# EAGLE design PCB_v3 (EAGLE 9.6.2)
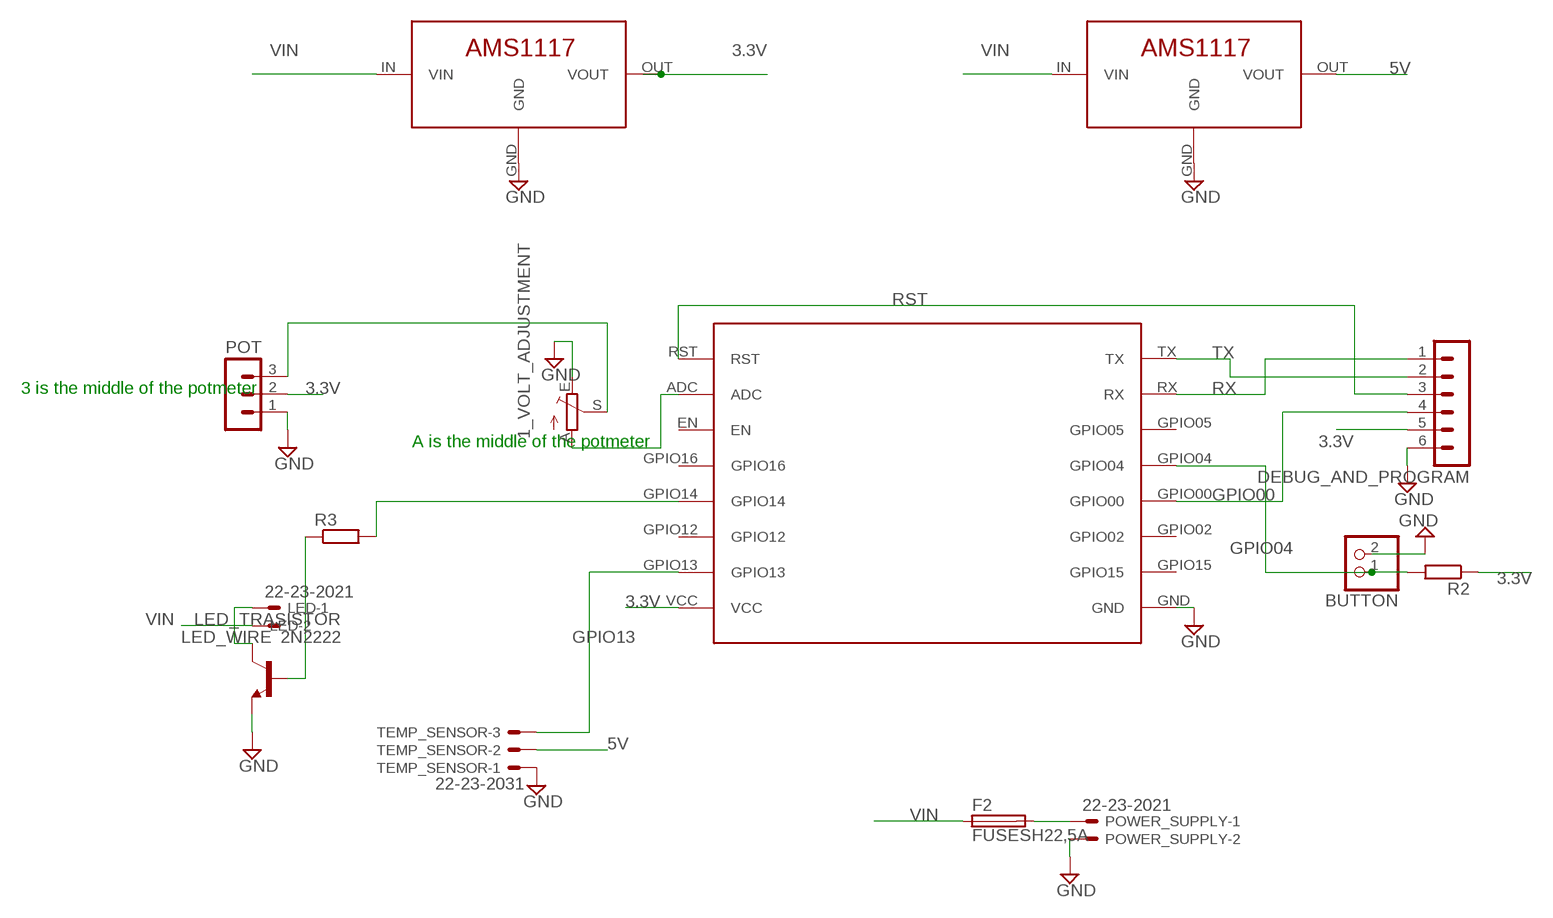
[diagram p0: schematic, sheet 1]

## Parts
1_VOLT_ADJUSTMENT  TRIM_EU-CA6V  [CA6V]
3.3V_REGULATOR  AMS1117  [AMS1117]
5V_REGULATOR  AMS1117  [AMS1117]
BUTTON  PINHD-1X2  [1X02]
DEBUG_AND_PROGRAM  MA06-1  [MA06-1]
F2  FUSESH22,5A  [SH22,5A]
LED  22-23-2021  [22-23-2021]
LED_TRASISTOR  2N2222  [2N2222]
POT  MA03-1  [MA03-1]
POWER_SUPPLY  22-23-2021  [22-23-2021]
R2  R-EU_0309/12  [0309/12]
R3  R-EU_0309/12  [0309/12]
TEMP_SENSOR  22-23-2031  [22-23-2031]
U$1  ESP8266  [ESP8266]

## Nets
3.3V: 3.3V_REGULATOR.OUT(VOUT) DEBUG_AND_PROGRAM.5 POT.2 R2.1 U$1.VCC
5V: 5V_REGULATOR.OUT(VOUT) TEMP_SENSOR.2
GND: 1_VOLT_ADJUSTMENT.E 3.3V_REGULATOR.GND 5V_REGULATOR.GND BUTTON.2 DEBUG_AND_PROGRAM.6 LED_TRASISTOR.E POT.1 POWER_SUPPLY.2 TEMP_SENSOR.1 U$1.GND
GPIO00: DEBUG_AND_PROGRAM.4 U$1.GPIO00
GPIO04: BUTTON.1 R2.2 U$1.GPIO04
GPIO13: TEMP_SENSOR.3 U$1.GPIO13
LED_WIRE: LED.1 LED_TRASISTOR.C
N$1: 1_VOLT_ADJUSTMENT.A U$1.ADC
N$2: 1_VOLT_ADJUSTMENT.S POT.3
N$3: F2.2 POWER_SUPPLY.1
N$8: R3.2 U$1.GPIO14
N$9: LED_TRASISTOR.B R3.1
RST: DEBUG_AND_PROGRAM.3 U$1.RST
RX: DEBUG_AND_PROGRAM.1 U$1.RX
TX: DEBUG_AND_PROGRAM.2 U$1.TX
VIN: 3.3V_REGULATOR.IN(VIN) 5V_REGULATOR.IN(VIN) F2.1 LED.2
Unconnected: U$1.EN U$1.GPIO02 U$1.GPIO05 U$1.GPIO12 U$1.GPIO15 U$1.GPIO16

## Notes on the sheet
- 3 is the middle of the potmeter
- A is the middle of the potmeter

## Library data of the parts
1_VOLT_ADJUSTMENT = pot:TRIM_EU-: POTENTIOMETER
3.3V_REGULATOR 5V_REGULATOR = MyLIB:AMS1117
BUTTON = pinhead:PINHD-1X2: PIN HEADER
DEBUG_AND_PROGRAM = con-lstb:MA06-1: PIN HEADER; OC_FARNELL: unknown; OC_NEWARK: unknown
F2 = fuse:FUSE: Fuse; OC_FARNELL: unknown; OC_NEWARK: unknown
LED POWER_SUPPLY = con-molex:22-23-2021: .100" (2.54mm) Center Header - 2 Pin; MF: MOLEX; MPN: 22-23-2021; OC_FARNELL: 1462926; OC_NEWARK: 25C3832
LED_TRASISTOR = MyLIB:2N2222: NPN Transistor
POT = con-lstb:MA03-1: PIN HEADER; OC_FARNELL: unknown; OC_NEWARK: unknown
R2 R3 = rcl:R-EU_: RESISTOR, European symbol; SPICEPREFIX: R
TEMP_SENSOR = con-molex:22-23-2031: .100" (2.54mm) Center Header - 3 Pin; MF: MOLEX; MPN: 22-23-2031; OC_FARNELL: 1462950; OC_NEWARK: 30C0862
U$1 = MyLIB:ESP8266

## Board
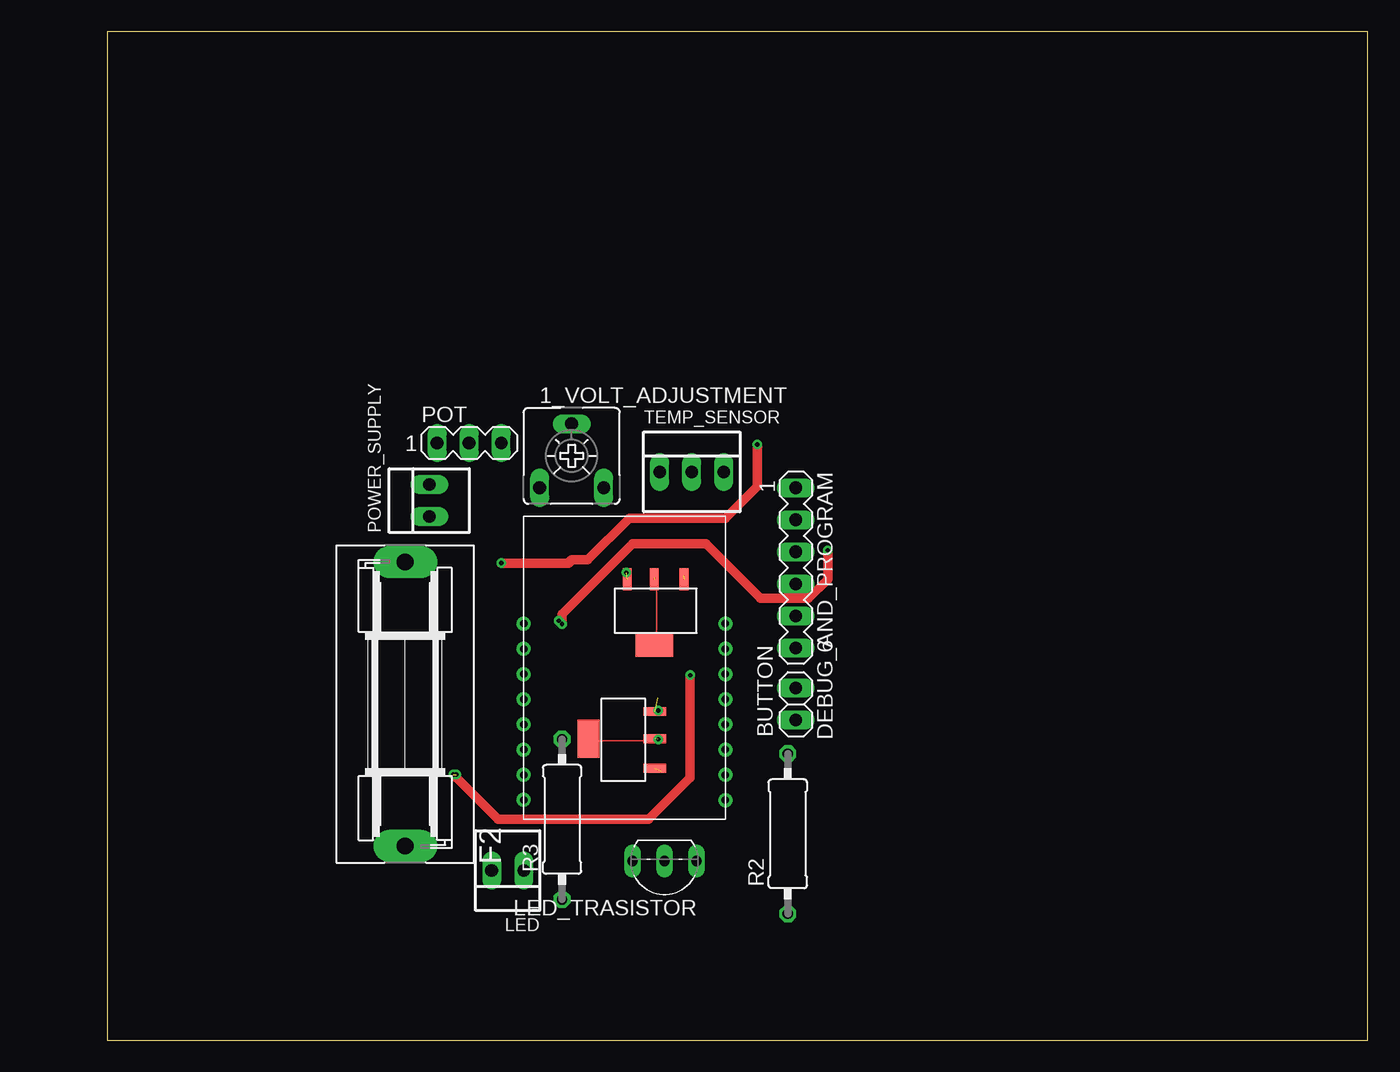
[diagram p1: board, top side]
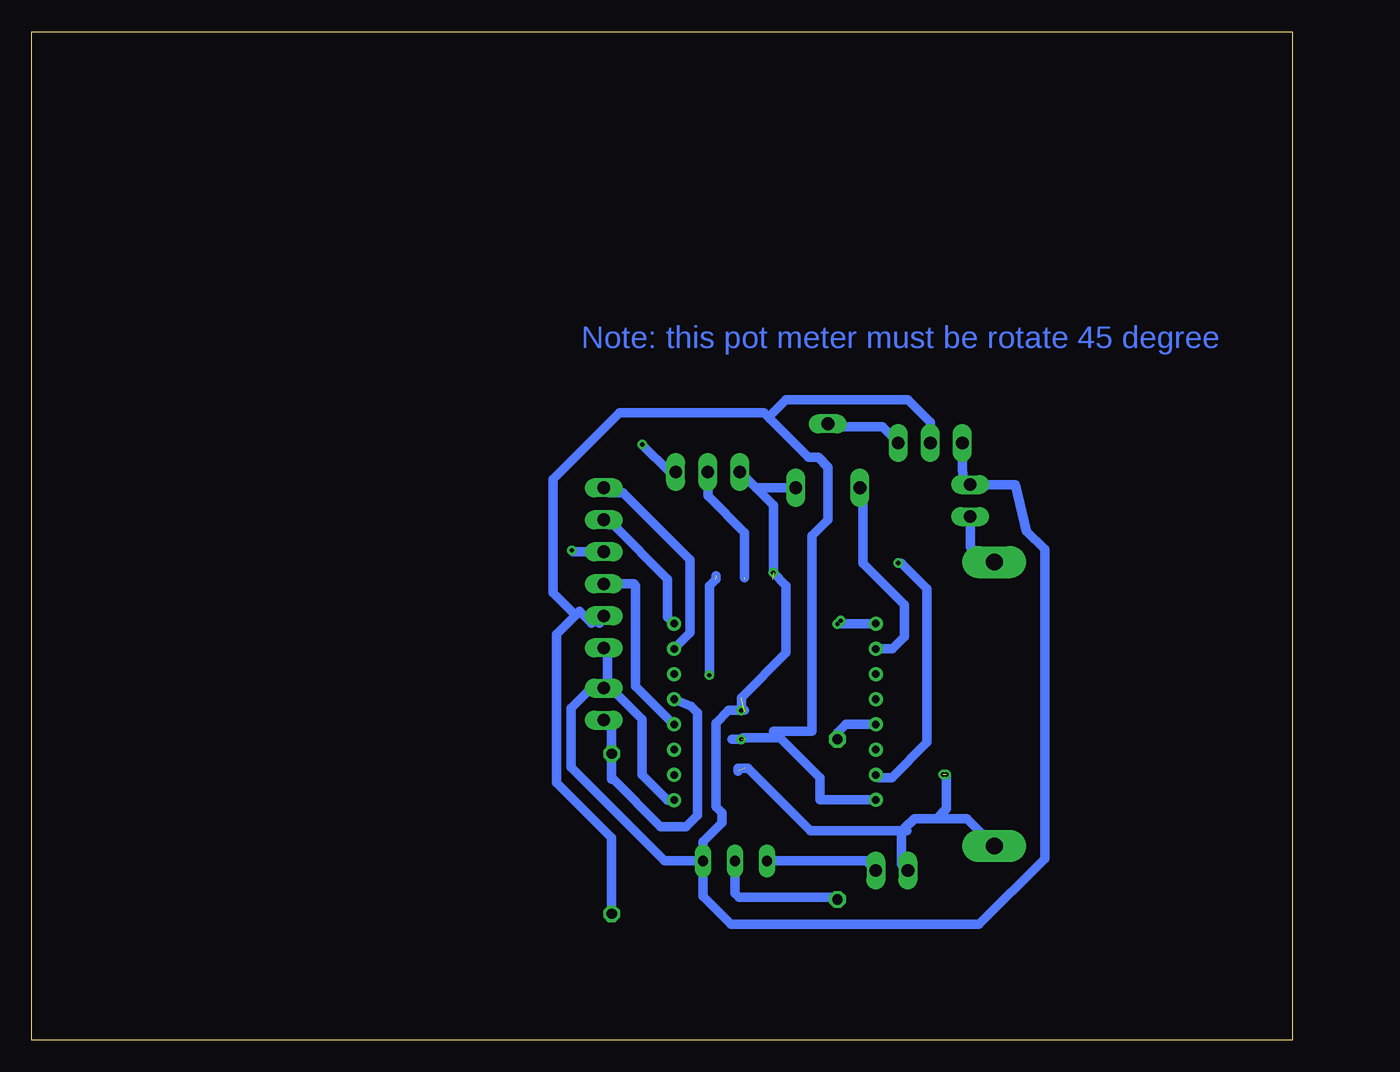
[diagram p2: board, bottom side, seen from below]

Size 100 x 80 mm. Coordinates in mm from the lower left corner, seen from the top.
Outline: 0,0 100,0 100,80 0,80 0,0
Copper layers (1*16): Top 0.035mm / dielectric 1.5mm / Bottom 0.035mm
Design rules "default *": minimum track width 30mil, minimum drill 0.35mm, track to track 15mil, track to pad 6mil, pad to pad 6mil, via to via 6mil, smd to smd 6mil, copper to edge 40mil, drill to drill 6mil, minimum pad ring 10mil, minimum via ring 8mil, stop-mask expansion 4mil, vias tented up to drill 0mil, thermal gap 10mil

### Footprints (pad centres in the part's own frame; a part is rotated, then mirrored left to right if it is on the bottom)
CA6V = drill 1.016 long: A -2.54,-2.54; E 2.54,-2.54; S 0,2.54
AMS1117 = smd 0.7 x 1.75: GND 5.5,-0.75; IN 1,-0.75; OUT 3.35,-0.75 | smd 3 x 1.75: OUT2 3.35,4.5
1X02 = drill 1.016 long: 1 -1.27,0; 2 1.27,0
MA06-1 = drill 1.016 long: 1 -6.35,0; 2 -3.81,0; 3 -1.27,0; 4 1.27,0; 5 3.81,0; 6 6.35,0
SH22,5A = drill 1.321 pad 2.54 long: 1 -11.252,0; 2 11.252,0
22-23-2021 = drill 1 long: 1 -1.27,0; 2 1.27,0
2N2222 = drill 0.813 long: B 0,-1.27; C 2.54,-1.27; E -2.54,-1.27
MA03-1 = drill 1.016 long: 1 -2.54,0; 2 0,0; 3 2.54,0
0309/12 = drill 0.813 octagon: 1 -6.35,0; 2 6.35,0
22-23-2031 = drill 1 long: 1 -2.54,0; 2 0,0; 3 2.54,0
ESP8266 = drill 0.6: ADC 0,12; EN 0,10; GND 16,0; GPIO00 16,6; GPIO02 16,4; GPIO04 16,8; GPIO05 16,10; GPIO12 0,4; GPIO13 0,2; GPIO14 0,6; GPIO15 16,2; GPIO16 0,8; RST 0,14; RX 16,12; TX 16,14; VCC 0.003,0.012

### Placement (x,y rotation side)
1_VOLT_ADJUSTMENT  36.83,46.35 0 top
3.3V_REGULATOR  42.67,20.57 90 top
5V_REGULATOR  46.74,35.81 180 top
BUTTON  54.61,26.67 90 top
DEBUG_AND_PROGRAM  54.61,37.47 270 top
F2  23.62,26.67 90 top
LED  31.75,13.46 180 top
LED_TRASISTOR  44.2,12.95 180 top
POT  28.7,47.37 0 top
POWER_SUPPLY  25.53,42.8 90 top
R2  53.98,16.38 90 top
R3  36.07,17.53 90 top
TEMP_SENSOR  46.35,45.09 0 top
U$1  33.02,19.05 0 top

### Tracks (layer width: path | path; a pad name or v marks a point on that pad's centre or on a via)
3.3V  (via drill 0.35)  (1 unrouted)
  Bottom 0.762: R2.1 53.98,16.07 58.36,20.45 58.36,32.19 56.83,33.72 | 56.83,33.72 56.52,34.04 55.56,33.08 55.24,33.4 54.93,33.08 54.57,33.44 DEBUG_AND_PROGRAM.5 | U$1.VCC 37.47,19.06 37.47,20.83 40.64,24 | 56.83,33.72 58.61,35.5 58.61,44.51 53.34,49.78 41.91,49.78 41.4,49.28 | 40.64,24 41.15,24.51 38.1,24.51 38.1,40.01 36.83,41.27 36.83,45.47 37.59,46.23 38.35,46.23 41.4,49.28 | 40.64,24 43.56,24 v43.69,23.88 44.45,23.88 | POT.2 28.7,49.02 30.48,50.8 40.13,50.8 41.4,49.53 41.4,49.28
5V  (1 unrouted)
  Bottom 0.762: TEMP_SENSOR.2 46.35,43.18 43.43,40.26 43.43,36.7
GND  (via drill 0.35)  (2 unrouted)
  Bottom 0.762: POT.1 26.16,45.21 26.08,44.62 POWER_SUPPLY.2 21.95,44.07 21.07,40.37 19.62,38.92 19.62,14.41 24.83,9.21 44.51,9.21 46.74,11.43 LED_TRASISTOR.E | U$1.GND 49.53,19.05 51.56,21.08 51.56,25.46 54.15,28.05 BUTTON.2 | LED_TRASISTOR.E 49.78,14.22 57.21,21.65 57.21,26.35 55.63,27.94 BUTTON.2 | LED_TRASISTOR.E 46.74,15.38 | DEBUG_AND_PROGRAM.6 54.29,30.86 54.29,28 54.4,27.9 BUTTON.2 | LED_TRASISTOR.E 46.74,15.75 45.21,17.27 45.21,18.03 45.72,18.54 45.72,25.15 44.7,26.16 v43.69,26.16 | v43.69,26.16 43.43,26.16 | v43.69,26.16 43.69,27.18 40.13,30.73 40.13,36.07 v41.15,37.08 41.15,42.42 TEMP_SENSOR.1 42.55,43.81 1_VOLT_ADJUSTMENT.E
GPIO00
  Bottom 0.762: U$1.GPIO00 49.15,25.15 52.07,28.07 52.07,36.07 52.2,36.2 DEBUG_AND_PROGRAM.4
GPIO04
  Bottom 0.762: U$1.GPIO04 47.69,26.48 47.18,25.97 47.18,17.84 48.07,16.95 50.1,16.95 53.92,20.77 53.98,20.7 R2.2 53.98,24.77 BUTTON.1
GPIO13  (via drill 0.35)
  Top 0.762: v31.24,37.85 36.58,37.85 36.83,38.1 38.1,38.1 41.4,41.4 49.02,41.4 51.56,43.94 v51.56,47.24
  Bottom 0.762: U$1.GPIO13 32.8,20.83 31.75,20.83 28.96,23.62 28.96,35.81 30.99,37.85 v31.24,37.85 | v51.56,47.24 49.4,45.09 TEMP_SENSOR.3
LED_WIRE
  Bottom 0.762: 41.34,14.54 LED_TRASISTOR.C 33.78,14.22 LED.1
N$1
  Bottom 0.762: U$1.ADC 31.69,31.05 30.73,32 30.73,34.54 34.04,37.85 34.04,43.56 1_VOLT_ADJUSTMENT.A
N$2
  Bottom 0.762: POT.3 32.51,48.64 36.58,48.64 1_VOLT_ADJUSTMENT.S
N$3
  Bottom 0.762: POWER_SUPPLY.1 25.53,39.11 24.48,37.92 F2.2
N$4  (via drill 0.35)
  other vias: 35.81,33.27
N$8
  Bottom 0.762: R3.2 36.07,24.38 35.4,25.05 U$1.GPIO14
N$9
  Bottom 0.762: LED_TRASISTOR.B 44.2,11.68 43.88,11.37 39.88,11.37 39.56,11.37 36.26,11.37 R3.1
RST  (via drill 0.35)
  Top 0.762: v36.07,33.02 36.07,33.78 41.66,39.37 47.5,39.37 51.82,35.05 55.63,35.05 57.15,36.58 v57.15,38.86 | DEBUG_AND_PROGRAM.3 54.74,38.86
  Bottom 0.762: v36.07,33.02 33.05,33.02 U$1.RST | v57.15,38.86 57.02,38.73 DEBUG_AND_PROGRAM.3
RX
  Bottom 0.762: DEBUG_AND_PROGRAM.1 54.23,43.43 53.09,43.43 47.75,38.1 47.75,32.32 U$1.RX
TX
  Bottom 0.762: DEBUG_AND_PROGRAM.2 54.23,40.89 53.85,40.89 49.53,36.57 49.53,33.56 U$1.TX
VIN  (via drill 0.35)  (3 unrouted)
  Top 0.762: v46.23,28.96 46.23,20.83 42.93,17.53 30.99,17.53 27.69,20.83 v27.69,21.08
  Bottom 0.762: 30.99,16.64 30.54,16.64 30.73,16.83 29.97,17.59 28.19,17.59 | 30.99,16.64 38.23,16.64 43.18,21.59 43.94,21.59 43.94,21.34 | 30.48,13.97 LED.2 30.99,13.97 30.99,16.64 | 28.19,17.59 25.79,17.59 F2.1 | v46.23,28.96 46.23,36.07 45.72,36.58 45.72,36.83 | 28.19,17.59 27.43,18.35 v27.43,21.08

### Text on the board
Bottom: Note: this pot meter must be rotate 45 degree